# EAGLE design FT232_BreakOutBoard (EAGLE 8.4.0)
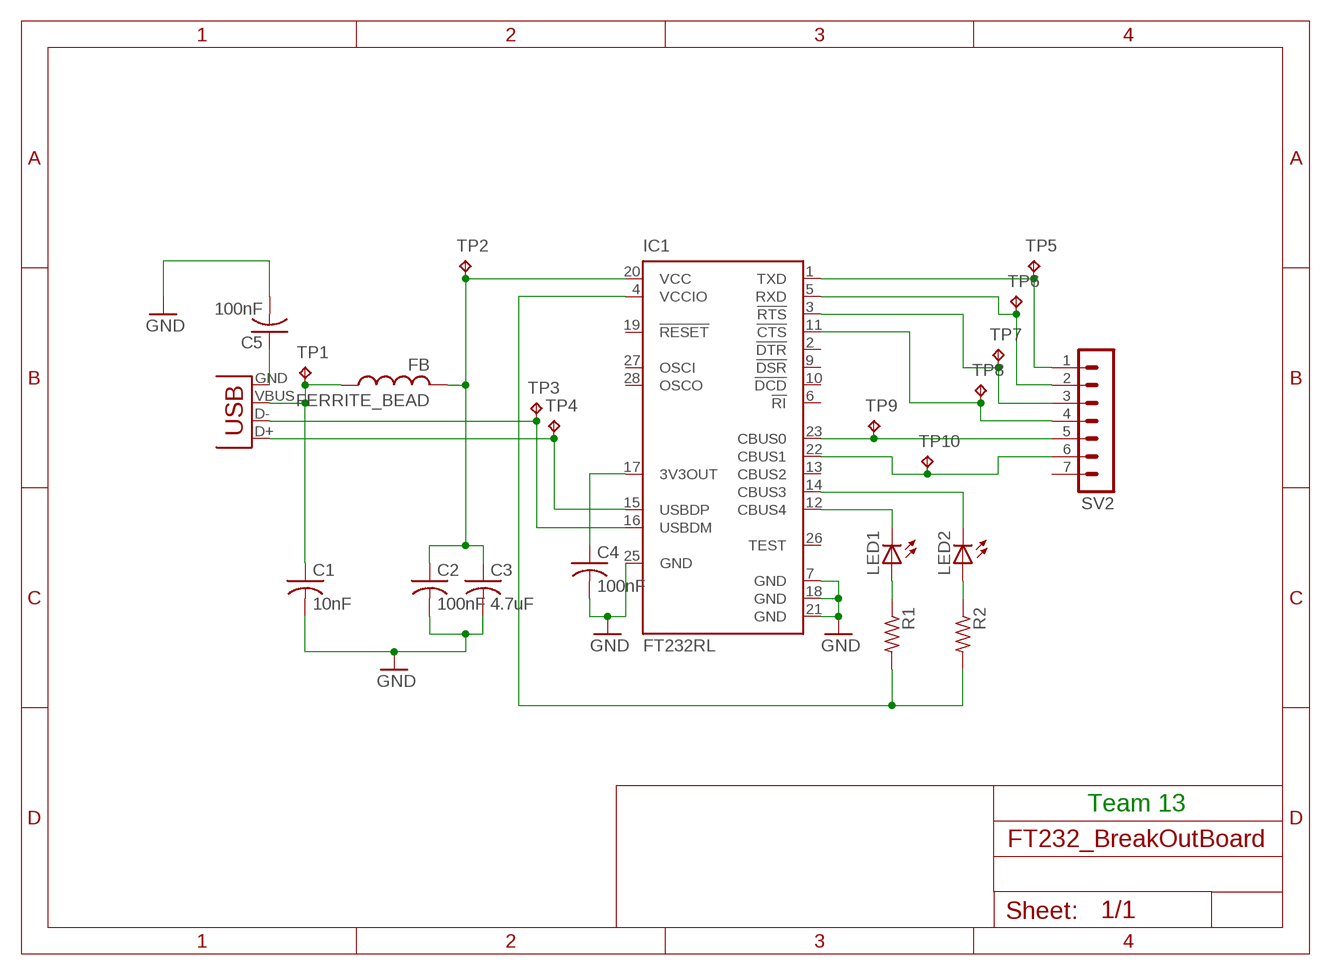
[diagram p0: schematic, sheet 1]

## Parts
C1  10nF  C-USC0805  [C0805]
C2  100nF  C-USC0805  [C0805]
C3  4.7uF  C-USC0805  [C0805]
C4  100nF  C-USC0805  [C0805]
C5  100nF  C-USC0805  [C0805]
FERRITE_BEAD  FB  [FB]
IC1  FT232RL  [SSOP28]
LED1  LEDCHIPLED_0805  [CHIPLED_0805]
LED2  LEDCHIPLED_0805  [CHIPLED_0805]
R1  R-US_R0805  [R0805]
R2  R-US_R0805  [R0805]
SV2  MA07-1  [MA07-1]
TP1  TPB1,27  [B1,27]
TP2  TPB1,27  [B1,27]
TP3  TPB1,27  [B1,27]
TP4  TPB1,27  [B1,27]
TP5  TPB1,27  [B1,27]
TP6  TPB1,27  [B1,27]
TP7  TPB1,27  [B1,27]
TP8  TPB1,27  [B1,27]
TP9  TPB1,27  [B1,27]
TP10  TPB1,27  [B1,27]
X1  USB-B-H  [USB-B-H]

## Nets
DELEETE: IC1.4(VCCIO) R1.2 R2.2
GND: C1.2 C2.2 C3.2 C4.2 C5.2 IC1.7(GND) IC1.18(GND) IC1.21(GND) IC1.25(GND)
N$1: C5.1 X1.GND
N$2: C4.1 IC1.17(3V3OUT)
N$3: IC1.15(USBDP) TP4.TP X1.D+
N$5: IC1.16(USBDM) TP3.TP X1.D-
N$6: IC1.1(TXD) SV2.1 TP5.TP
N$7: C1.1 FERRITE_BEAD.P$1 TP1.TP X1.VBUS
N$8: IC1.5(RXD) SV2.2 TP6.TP
N$9: IC1.3(!RTS) SV2.3 TP7.TP
N$10: IC1.11(!CTS) SV2.4 TP8.TP
N$11: IC1.23(CBUS0) SV2.5 TP9.TP
N$12: LED2.A R2.1
N$13: LED1.A R1.1
N$14: IC1.22(CBUS1) SV2.6 TP10.TP
N$15: IC1.12(CBUS4) LED1.C
N$16: IC1.14(CBUS3) LED2.C
N$17: C2.1 C3.1 FERRITE_BEAD.P$2 IC1.20(VCC) TP2.TP
Unconnected: IC1.2(!DTR) IC1.6(!RI) IC1.9(!DSR) IC1.10(!DCD) IC1.13(CBUS2) IC1.19(!RESET) IC1.26(TEST) IC1.27(OSCI) IC1.28(OSCO) SV2.7

## Notes on the sheet
- Team 13

## Library data of the parts
C1-C5 = adafruit:C-US: CAPACITOR, American symbol
FERRITE_BEAD = adafruit:FB: Ferrite bead Digikey #P9821BK-ND
IC1 = ftdichip:FT232R: Source: http://www.ftdichip.com/Documents/DataSheets/DS_FT232R_v104.pdf; MPN: FT232RL; OC_FARNELL: 1146032; OC_NEWARK: 91K9918
LED1 LED2 = adafruit:LED: LED OSRAM: - CHIPLED LG R971, LG N971, LY N971, LG Q971, LY Q971, LO R971, LY R971 LH N974, LH R974 LS Q976, LO Q976, LY Q976 LO Q996 - Hyper CHIPLED LW Q18S LB Q993, LB Q99A, LB R99A - SideLED LS A670, LO A670, LY A670, LG A670, LP A670 LB A673, LV A673, LT A673, LW A673 LH A674 LY A675 LS A676, LA A676, LO A676, LY A676, LW A676 LS A679, LY A679, LG A679 - Hyper Micro SIDELED® LS Y876, LA Y876, LO Y876, LY Y876 LT Y87S - SmartLED LW L88C, LW L88S LB L89C, LB L89S, LG L890 LS L89K, LO L89K, LY L89K LS L896, LA L896, LO L896, LY L896 - TOPLED LS T670, LO T670, LY T670, LG T670, LP T670 LSG T670, LSP T670, LSY T670, LOP T670, LYG T670 LG T671, LOG T671, LSG T671 LB T673, LV T673, LT T673, LW T673 LH T674 LS T676, LA T676, LO T676, LY T676, LB T676, LH T676, LSB T676, LW T676 LB T67C, LV T67C, LT T67C, LS T67K, LO T67K, LY T67K, LW E67C LS E67B, LA E67B, LO E67B, LY E67B, LB E67C, LV E67C, LT E67C LW T67C LS T679, LY T679, LG T679 LS T770, LO T770, LY T770, LG T770, LP T770 LB T773, LV T773, LT T773, LW T773 LH T774 LS E675, LA E675, LY E675, LS T675 LS T776, LA T776, LO T776, LY T776, LB T776 LHGB T686 LT T68C, LB T68C - Hyper Mini TOPLED® LB M676 - Mini TOPLED Santana® LG M470 LS M47K, LO M47K, LY M47K Source: http://www.osram.convergy.de/
R1 R2 = adafruit:R-US_: RESISTOR, American symbol
SV2 = con-lstb:MA07-1: PIN HEADER; OC_FARNELL: unknown; OC_NEWARK: unknown
TP1-TP10 = testpad:TP: Test pad
X1 = con-usb:USB: USB Connectors

## Board
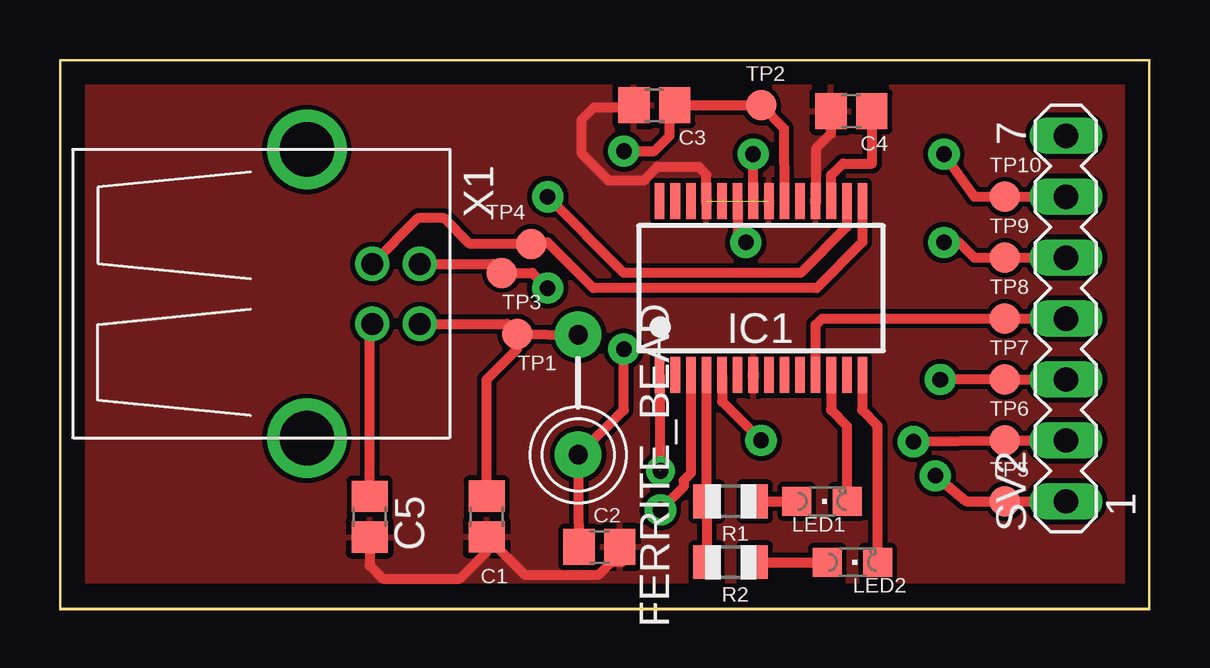
[diagram p1: board, top side]
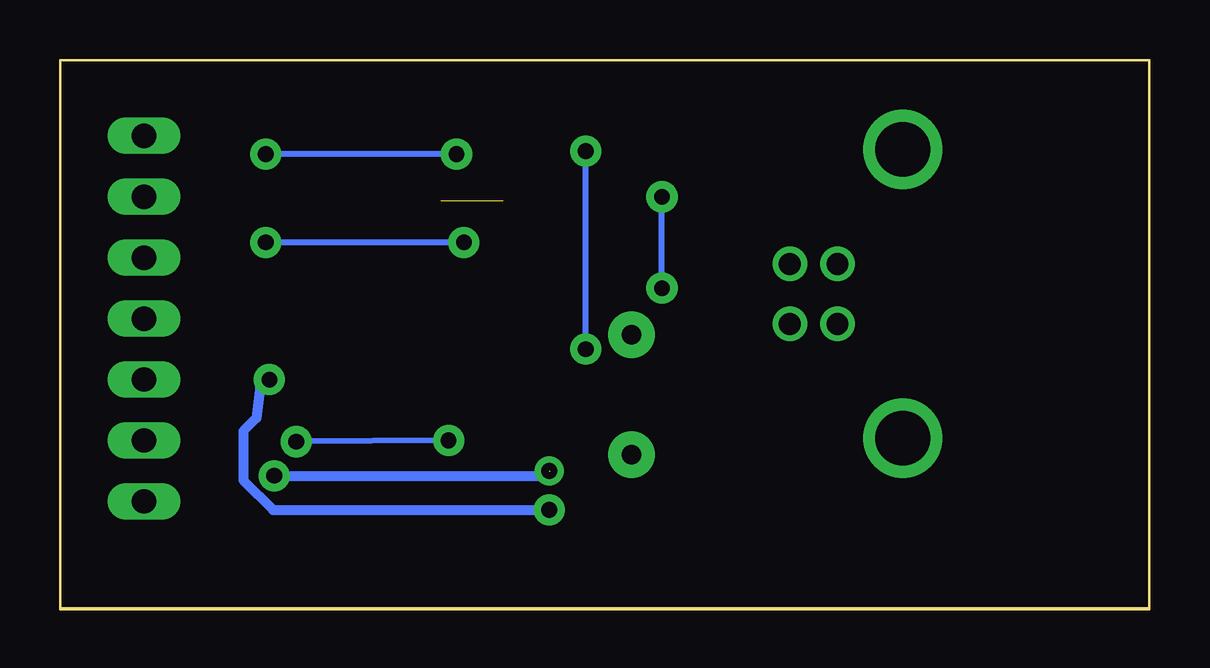
[diagram p2: board, bottom side, seen from below]

Size 45.4 x 22.85 mm. Coordinates in mm from the lower left corner, seen from the top.
Outline: 0,0 45.4,0 45.4,22.85 0,22.85 0,0
Copper layers (1*16): Top 0.035mm / dielectric 1.5mm / Bottom 0.035mm
Design rules "default": minimum track width 10mil, minimum drill 24mil, track to track 8mil, track to pad 8mil, pad to pad 8mil, via to via 8mil, smd to smd 8mil, copper to edge 40mil, drill to drill 8mil, minimum pad ring 10mil, minimum via ring 8mil, stop-mask expansion 4mil, vias tented up to drill 0mil, thermal gap 10mil
Milling: 4 lines

### Footprints (pad centres in the part's own frame; a part is rotated, then mirrored left to right if it is on the bottom)
C0805 = smd 1.3 x 1.5: 1 -0.85,0; 2 0.85,0
FB = drill 0.8 pad 1.93: P$1 -2.5,0; P$2 2.5,0
SSOP28 = smd 0.4 x 1.5: 1 -4.225,-3.625; 2 -3.575,-3.625; 3 -2.925,-3.625; 4 -2.275,-3.625; 5 -1.625,-3.625; 6 -0.975,-3.625; 7 -0.325,-3.625; 8 0.325,-3.625; 9 0.975,-3.625; 10 1.625,-3.625; 11 2.275,-3.625; 12 2.925,-3.625; 13 3.575,-3.625; 14 4.225,-3.625; 15 4.225,3.625; 16 3.575,3.625; 17 2.925,3.625; 18 2.275,3.625; 19 1.625,3.625; 20 0.975,3.625; 21 0.325,3.625; 22 -0.325,3.625; 23 -0.975,3.625; 24 -1.625,3.625; 25 -2.275,3.625; 26 -2.925,3.625; 27 -3.575,3.625; 28 -4.225,3.625
CHIPLED_0805 = smd 1.2 x 1.2: A 0,-1.05; C 0,1.05
R0805 = smd 1.1 x 1.4: 1 -1,0; 2 1,0
MA07-1 = drill 1.016 long: 1 -7.62,0; 2 -5.08,0; 3 -2.54,0; 4 0,0; 5 2.54,0; 6 5.08,0; 7 7.62,0
B1,27 = smd 1.27 x 1.27: TP 0,0
USB-B-H = drill 0.914: D+ 0,1.25; D- 1.981,1.25; GND 0,-1.25; VBUS 1.981,-1.25 | drill 2.286: P$1 -2.718,-6.02; P$2 -2.718,6.02

### Placement (x,y rotation side)
C1  17.78,3.81 270 top
C2  22.48,2.54 0 top
C3  24.77,20.95 180 top
C4  32.97,20.71 180 top
C5  12.91,3.8 270 top
FERRITE_BEAD  21.59,8.89 270 top
IC1  29.21,13.33 0 top
LED1  31.75,4.45 270 top
LED2  33.02,1.91 270 top
R1  27.94,4.45 180 top
R2  27.94,1.91 180 top
SV2  41.91,12.06 90 top
TP1  19.05,11.43 0 top
TP2  29.21,20.95 0 top
TP3  18.41,13.97 0 top
TP4  19.64,15.18 0 top
TP5  39.37,4.45 0 top
TP6  39.37,6.98 0 top
TP7  39.37,9.53 0 top
TP8  39.37,12.06 0 top
TP9  39.37,14.61 0 top
TP10  39.37,17.14 0 top
X1  13.01,13.1 0 top

### Tracks (layer width: path | path; a pad name or v marks a point on that pad's centre or on a via)
DELEETE
  Top 0.254: R1.2
  Top 0.406: IC1.4 R1.2 | R1.2 R2.2
GND  (1 unrouted)
  Top 0.406: C5.2 12.91,1.77 13.46,1.22 16.67,1.22 17.78,2.33 C1.2 19.36,1.38 22.45,1.38 22.99,1.92 23.42,1.92 23.42,2.45 C2.2 | IC1.25 26.94,18.07 26.62,18.38 24.88,18.38 24.38,17.88 24.38,17.87 24.34,17.82 22.86,17.82 21.75,18.94 21.75,20.36 22.25,20.87 23.83,20.87 C3.2 | C4.2 32.12,19.77 31.5,19.14 31.5,16.97 IC1.18
  pour Top: 0,22.86 0,0 44.45,0 44.45,22.86
N$1
  Top 0.406: C5.1 12.91,11.75 X1.GND
N$2
  Top 0.406: IC1.17 32.14,18.05 32.62,18.53 33.84,18.53 C4.1
N$3
  Top 0.254: 20.32,15.24 TP4.TP
  Top 0.406: 20.32,15.24 22.23,13.33 31.52,13.33 33.44,15.25 IC1.15 | TP4.TP 17.08,15.18 16,16.25 14.91,16.25 X1.D+
N$5  (via drill 0.65 pad 1.3)
  Top 0.406: v20.32,13.33 19.69,13.97 TP3.TP 18.04,14.35 X1.D- | v20.32,17.14 23.5,13.97 30.86,13.97 32.79,15.89 IC1.16
  Bottom 0.254: v20.32,13.33 v20.32,17.14
N$6  (via drill 0.65 pad 1.2, 0.65 pad 1.3)  (1 unrouted)
  Top 0.406: v36.47,5.51 37.74,4.44 TP5.TP SV2.1 | IC1.1 24.99,5.71
  Bottom 0.406: v36.47,5.51 25.22,5.51 v25.02,5.71
N$7
  Top 0.254: TP1.TP 19.05,10.79
  Top 0.406: C1.1 17.78,9.52 19.05,10.79 | FERRITE_BEAD.P$1 TP1.TP 18.63,11.85 X1.VBUS
N$8  (via drill 0.65 pad 1.3)
  Top 0.406: IC1.5 27.59,8.61 v29.21,6.98 | v35.56,6.93 TP6.TP SV2.2
  Bottom 0.254: v29.21,6.98 v35.56,6.93
N$9  (via drill 0.65 pad 1.3)
  Top 0.406: v36.68,9.52 TP7.TP SV2.3 | v25.02,4.09 25.98,5.05 25.98,5.31 26.29,5.61 IC1.3
  Bottom 0.406: v36.68,9.52 37.06,9.24 37.22,7.92 37.76,7.37 37.76,5.33 36.53,4.09 v25.02,4.09
N$10
  Top 0.406: IC1.11 31.49,11.8 31.75,12.06 TP8.TP SV2.4
N$11  (via drill 0.65 pad 1.3)
  Top 0.406: IC1.23 28.24,15.58 v28.58,15.24 | v36.83,15.24 37.47,15.24 38.1,14.6 TP9.TP SV2.5
  Bottom 0.254: v28.58,15.24 v36.83,15.24
N$12
  Top 0.406: R2.1 LED2.A
N$13
  Top 0.406: R1.1 LED1.A
N$14  (via drill 0.65 pad 1.3)
  Top 0.406: IC1.22 28.89,18.09 v28.88,18.92 | v36.83,18.92 38.1,17.14 TP10.TP SV2.6
  Bottom 0.254: v28.88,18.92 v36.83,18.92
N$15
  Top 0.254: 32.14,8.26 32.13,8.25
  Top 0.406: LED1.C 32.8,7.57 32.13,8.25 | IC1.12 32.14,8.26
N$16
  Top 0.254: 33.44,8.26 33.43,8.25
  Top 0.406: LED2.C 34.07,7.59 33.43,8.25 | IC1.14 33.44,8.26
N$17  (via drill 0.65 pad 1.3)
  Top 0.254: 25.4,20.32 25.62,20.53 C3.1 | 30.17,20 30.18,19.99
  Top 0.406: v23.5,10.79 23.5,8.25 FERRITE_BEAD.P$2 C2.1 | v23.5,19.05 24.77,19.05 25.4,19.68 25.4,20.32 | IC1.20 30.17,20 TP2.TP C3.1
  Bottom 0.254: v23.5,10.79 v23.5,19.05